# Altium schematic sheet CLK_ICS307-02_PLL.SchDoc: Programmable SPI Clock
size A4; Organization: Altium Limited.; Address1: Level 3, 12a Rodborough Rd; Address2: Frenchs Forest 2086; Address3: NSW; Address4: AUSTRALIA; Revision: 6; SheetNumber: 11; SheetTotal: 64
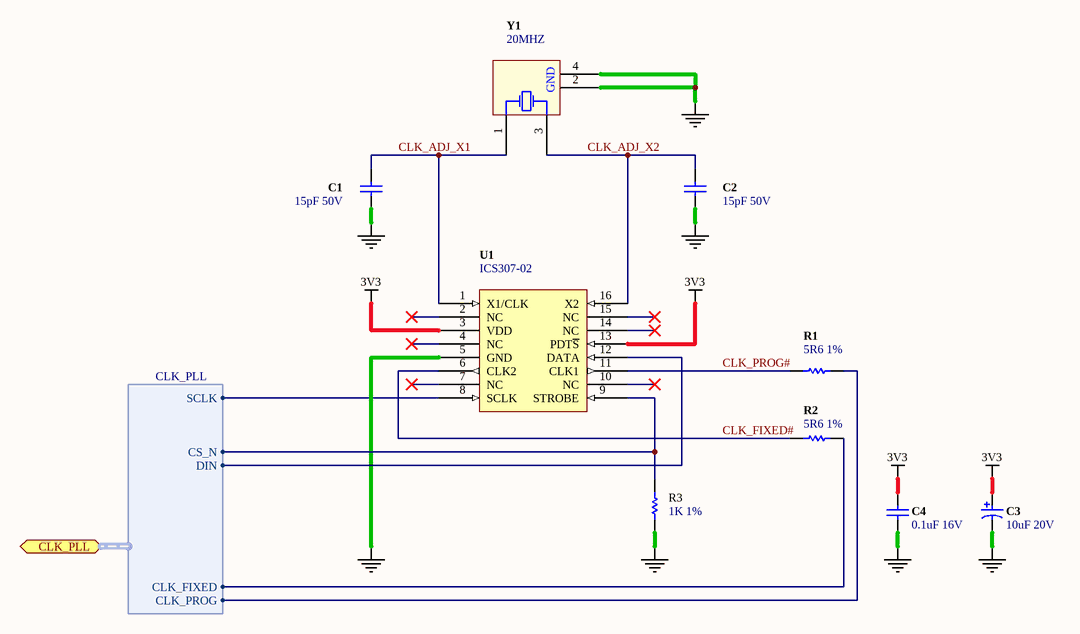
[diagram p0: CLK_ICS307-02_PLL.SchDoc]

## Parts
C1  15pF 50V  [CAPC1005-STAR]
C2  15pF 50V  [CAPC1005-STAR]
C3  10uF 20V  [CAPC3528-STAR]
C4  0.1uF 16V  [CAPC1005-STAR]
R1  5R6 1%  [RESC1005-STAR]
R2  5R6 1%  [RESC1005-STAR]
R3  1K 1%  [RESC1005-STAR]
U1  ICS307-02  [SOIC127P600-16]
Y1  20MHZ  [XTAL-200X126-4]

## Ports
CLK_PLL (harness CLK_PLL)

## Harnesses
CLK_PLL: CLK_FIXED, CLK_PROG, CS_N, DIN, SCLK

## Nets
3V3: C3.1 C4.1 U1.3(VDD) U1.13(PDT~{S})
GND: C1.2 C2.2 C3.2 C4.2 R3.2 U1.5(GND) Y1.2(GND) Y1.4(GND)
CLK_ADJ_X1: C1.1 U1.1(X1/CLK) Y1.1(X1)
CLK_ADJ_X2: C2.1 U1.16(X2) Y1.3(X2)
CLK_FIXED#: R2.2 U1.6(CLK2)
CLK_PROG#: R1.2 U1.11(CLK1)
NetR1_1: R1.1 ; port CLK_PLL.CLK_PROG
NetR2_1: R2.1 ; port CLK_PLL.CLK_FIXED
NetR3_1: R3.1 U1.9(STROBE) ; port CLK_PLL.CS_N
NetU1_8: U1.8(SCLK) ; port CLK_PLL.SCLK
NetU1_12: U1.12(DATA) ; port CLK_PLL.DIN

Not connected (* = marked no-connect by the designer): U1 2(NC)* 4(NC)* 7(NC)* 10(NC)* 14(NC)* 15(NC)*

## Notes on the sheet
- Sheet Title
- Project Title
- Size:
- Date:
- A4
- Assy:
- Time:
- Sheet
- Revision:
- of
- File:

## Library data of the parts
C1 C2 = D-101-0075: Capacitor, Ceramic, 15pF 5% 50V 0402 (1005); Dielectric: C0G; Polarity: Non-Polarized; Category: Capacitor; Capacitance: 15 pF; Mounting Technology: Surface Mount; Rated Voltage: 50 V; Status: Production; Technology: Ceramic; Tolerance: 5 %
C3 = D-101-0007: Capacitor, Tantalum, 10uF 10% 20V MCCT-B (3528); Polarity: Polarized; Category: Capacitor; Capacitance: 10 uF; Mounting Technology: Surface Mount; Rated Voltage: 20 V; Status: Production; Technology: Tantalum; Tolerance: 10 %
C4 = D-101-0080: Capacitor, Ceramic, 0.1uF 10% 16V 0402 (1005) X7R; Polarity: Non-Polarized; Category: Capacitor; Capacitance: 0.1 uF; Dielectric: X7R; Mounting Technology: Surface Mount; Rated Voltage: 16 V; Status: Production; Technology: Ceramic; Tolerance: 10 %
R1 R2 = D-100-0085: Resistor, 5R6 1% 0402 (1005); Power Rating: 63 mW; Resistance: 5.6 R; Category: Resistor; Status: Production; Mounting Technology: Surface Mount; Tolerance: 1 %
R3 = D-100-0121: Resistor, 1K 1% 0402 (1005); Power Rating: 63 mW; Category: Resistor; Mounting Technology: Surface Mount; Resistance: 1 K; Status: Production; Tolerance: 1 %
U1 = D-206-0000: ICS307-02, SPI Programmable Clock Generator; Category: IC-Clock; Status: Production
Y1 = D-103-0012: Crystal, SMD, 20.000000MHz Stab=30ppm 20.0pF; Frequency Stability: 30 ppm; Load Capacitance: 20 pF; Nominal Operational Voltage: mV; Category: Crystal; Frequency Tolerance: 30 ppm; Mounting Technology: Surface Mount; Nominal Fequency: 20 MHz; Status: Unreleased